# Altium schematic sheet Voltage_conversion.SchDoc
size A4; SheetNumber: 3; SheetTotal: 13
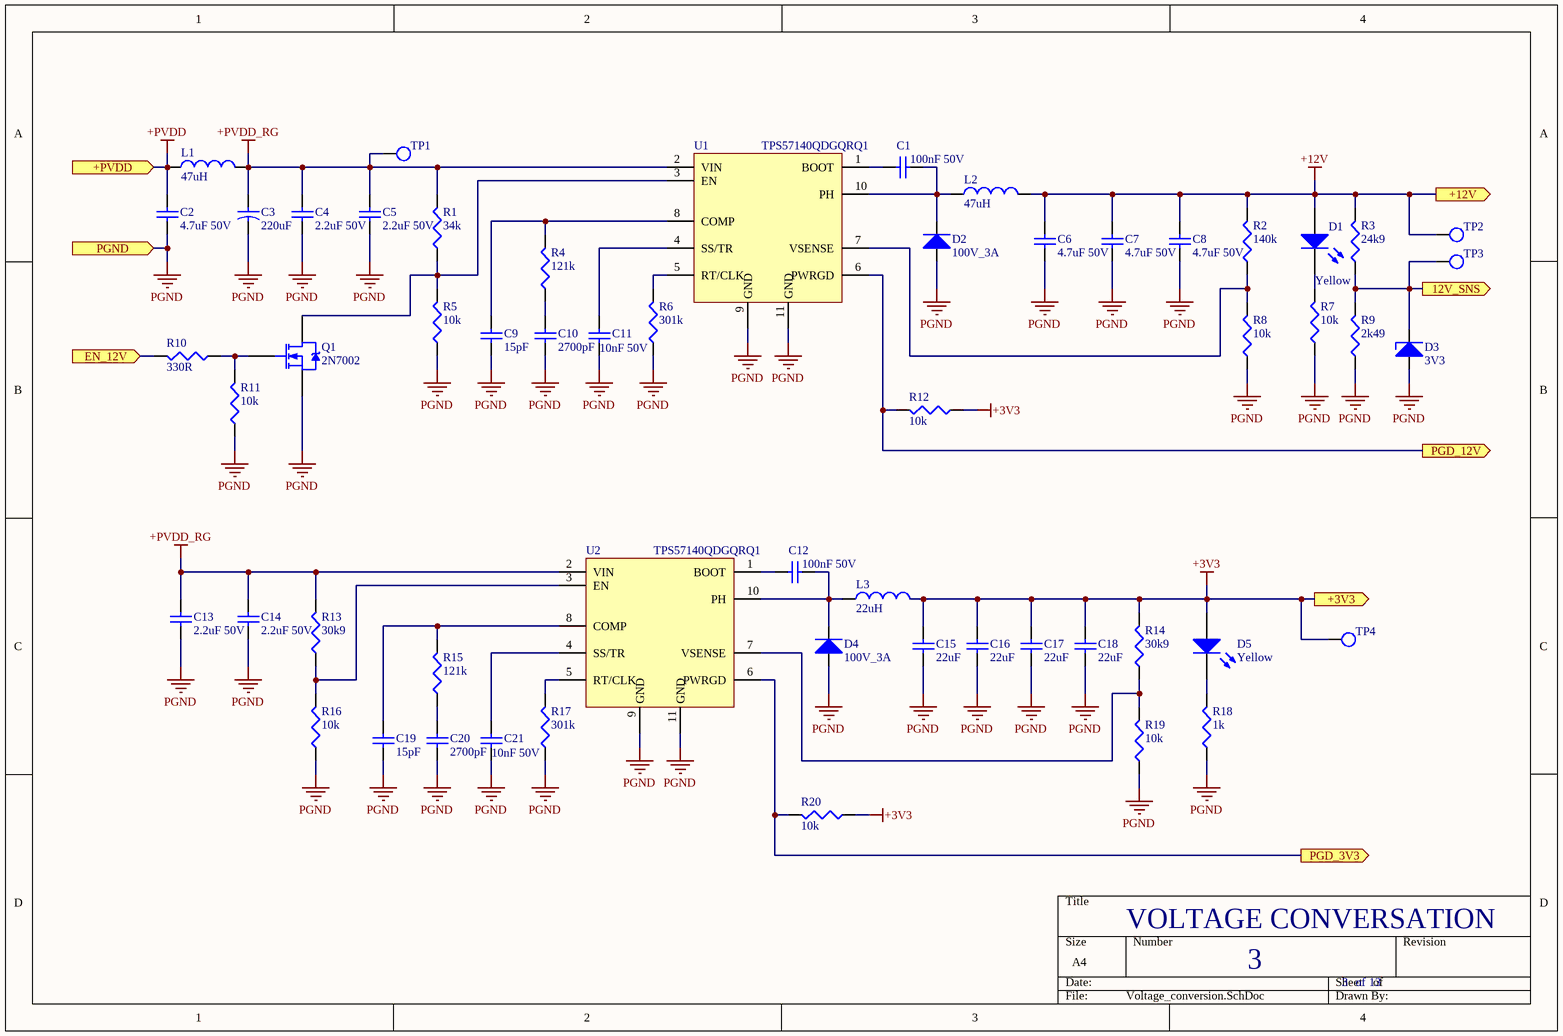
[diagram p0: Voltage_conversion.SchDoc]

## Parts
C1  100nF 50V  [CAP0603]
C2  4.7uF 50V  [CAP1206]
C3  220uF  [CAP_RADIAL_SMD_10x10]
C4  2.2uF 50V  [CAP1206]
C5  2.2uF 50V  [CAP1206]
C6  4.7uF 50V  [CAP1206]
C7  4.7uF 50V  [CAP1206]
C8  4.7uF 50V  [CAP1206]
C9  15pF  [CAP0603]
C10  2700pF  [CAP0603]
C11  10nF 50V  [CAP0603]
C12  100nF 50V  [CAP0603]
C13  2.2uF 50V  [CAP1206]
C14  2.2uF 50V  [CAP1206]
C15  22uF  [CAP1206]
C16  22uF  [CAP1206]
C17  22uF  [CAP1206]
C18  22uF  [CAP1206]
C19  15pF  [CAP0603]
C20  2700pF  [CAP0603]
C21  10nF 50V  [CAP0603]
D1  Yellow  [LED0603]
D2  100V_3A  [DO-221A]
D3  3V3  [SOD323]
D4  100V_3A  [DO-221A]
D5  Yellow  [LED0603]
L1  47uH  [IND_SRR1208]
L2  47uH  [IND_SRR1208]
L3  22uH  [IND_VLS]
Q1  2N7002  [SOT23_2N7002]
R1  34k  [RES0603]
R2  140k  [RES0603]
R3  24k9  [RES0603]
R4  121k  [RES0603]
R5  10k  [RES0603]
R6  301k  [RES0603]
R7  10k  [RES0603]
R8  10k  [RES0603]
R9  2k49  [RES0603]
R10  330R  [RES0603]
R11  10k  [RES0603]
R12  10k  [RES0603]
R13  30k9  [RES0603]
R14  30k9  [RES0603]
R15  121k  [RES0603]
R16  10k  [RES0603]
R17  301k  [RES0603]
R18  1k  [RES0603]
R19  10k  [RES0603]
R20  10k  [RES0603]
TP1  TEST_POINT  [TEST_POINT_TH]  (value not drawn)  (no BOM)
TP2  TEST_POINT  [TEST_POINT_TH]  (value not drawn)  (no BOM)
TP3  TEST_POINT  [TEST_POINT_TH]  (value not drawn)  (no BOM)
TP4  TEST_POINT  [TEST_POINT_TH]  (value not drawn)  (no BOM)
U1  P/N: TPS57140QDGQRQ1  [MSOP_EP]  (hidden comment: 1.5A)
U2  P/N: TPS57140QDGQRQ1  [MSOP_EP]  (hidden comment: 1.5A)

## Ports
12V_SNS (out), +3V3 (out), +12V (out), +PVDD (in), EN_12V (in), PGD_3V3 (out), PGD_12V (out), PGND (in)

## Nets
+3V3: C15.2 C16.2 C17.2 C18.2 D5.1(A) L3.2 R12.1 R14.2 R20.1 TP4.1 ; port +3V3
+12V: C6.2 C7.2 C8.2 D1.1(A) L2.2 R2.2 R3.2 TP2.1 ; port +12V
+PVDD: C2.2 L1.1 ; port +PVDD
+PVDD_RG: C3.1 C4.2 C5.2 C13.2 C14.2 L1.2 R1.2 R13.2 TP1.1 U1.2(VIN) U2.2(VIN)
PGND: C2.1 C3.2 C4.1 C5.1 C6.1 C7.1 C8.1 C9.1 C10.1 C11.1 C13.1 C14.1 C15.1 C16.1 C17.1 C18.1 C19.1 C20.1 C21.1 D2.2(A) D3.2(A) D4.2(A) Q1.2(S) R5.1 R6.1 R7.1 R8.1 R9.1 R11.1 R16.1 R17.1 R18.1 R19.1 U1.9(GND) U1.11(GND) U2.9(GND) U2.11(GND) ; port PGND
12V_SNS: D3.1(K) R3.1 R9.2 TP3.1 ; port 12V_SNS
EN_12V: R10.2 ; port EN_12V
PGD_3V3: R20.2 U2.6(PWRGD) ; port PGD_3V3
PGD_12V: R12.2 U1.6(PWRGD) ; port PGD_12V
NetC1_1: C1.1 D2.1(K) L2.1 U1.10(PH)
NetC1_2: C1.2 U1.1(BOOT)
NetC9_2: C9.2 R4.2 U1.8(COMP)
NetC10_2: C10.2 R4.1
NetC11_2: C11.2 U1.4(SS/TR)
NetC12_1: C12.1 D4.1(K) L3.1 U2.10(PH)
NetC12_2: C12.2 U2.1(BOOT)
NetC19_2: C19.2 R15.2 U2.8(COMP)
NetC20_2: C20.2 R15.1
NetC21_2: C21.2 U2.4(SS/TR)
NetD1_2: D1.2(K) R7.2
NetD5_2: D5.2(K) R18.2
NetQ1_1: Q1.1(G) R10.1 R11.2
NetQ1_3: Q1.3(D) R1.1 R5.2 U1.3(EN)
NetR2_1: R2.1 R8.2 U1.7(VSENSE)
NetR6_2: R6.2 U1.5(RT/CLK)
NetR13_1: R13.1 R16.2 U2.3(EN)
NetR14_1: R14.1 R19.2 U2.7(VSENSE)
NetR17_2: R17.2 U2.5(RT/CLK)

## Notes on the sheet
- VOLTAGE CONVERSATION
- of

## Library data of the parts
C1 C12 = CAP0603_100nF: CAP CER 0.1UF 50V X7R 0603; P/N: C0603C104K5RACTU; Order Code: DIGI : 399-5089-1-ND; Value: 100nF 50V
C2 C6-C8 = CAP1206_4.7uF: CAP CER 4.7UF 50V %20 X7R 1206; P/N: GRJ31CR71H475KE11L; Order Code: DIGI : 490-10944-1-ND; Value: 4.7uF 50V
C3 = CAP_RADIAL_EEE-FK1H221GP: CAP ALUM 220UF 20% 50V SMD; Value: 220uF 50V; Order Code: DIGI : PCE4324CT-ND; P/N: EEE-FK1H221GP
C4 C5 C13 C14 = CAP1206_2.2uF_50V: CAP CER 2.2UF 50V X7R 1206; P/N: C1206X225K5RACAUTO; Order Code: DIGI : 399-7041-1-ND; Value: 2.2uF 50V
C9 C19 = CAP0603_15pF: CAP CER 15PF 50V C0G/NP0 0603; P/N: 06035A150JAT4A; Order Code: DIGI : 478-10677-1-ND; Value: 15pF 50V
C10 C20 = CAP0603_2700pF: CAP CER 1200PF 50V X7R 0603; P/N: CL10B272KB8NNNC; Value: 2700pF 50V; Order Code: DIGI : 1276-2022-1-ND
C11 C21 = CAP0603_10nF: CAP CER 10nF 50V X7R 0603; P/N: C0603C103K5RACTU; Order Code: DIGI : 399-1091-1-ND; Value: 10nF 50V
C15-C18 = CAP1206_22uF_16V: CAP CER 22UF 16V X6S 1206; P/N: GRT31CC81C226KE01L; Order Code: DIGI : 490-12409-1-ND; Value: 22uF
D1 D5 = LED0603_YELLOW: LED YELLOW CLEAR 0603 SMD; P/N: 150060YS75000; Order Code: DIGI : 732-4981-1-ND; Value: Yellow
D2 D4 = FRED_VS-3EYH01-M3/H_100V_3A: DIODE FRED 100V 3A DO-221AD; Value: 100V 3A; Order Code: DIGI : 112-VS-3EYH01-M3/HCT-ND; P/N: VS-3EYH01-M3/H
D3 = ZENER_3V3_MM3Z3V3T1G: DIODE ZENER 3.3V 300MW SOD323; Order Code: DIGI : MM3Z3V3T1GOSCT-ND; P/N: MM3Z3V3T1G; Value: 3V3
L1 L2 = IND_SRR1280-470M: FIXED IND 47UH 2.9A 80 MOHM SMD; Order Code: DIGI : SRR1280-470MCT-ND; P/N: SRR1280-470M; Value: 47uH
L3 = IND_VLS6045EX-220M-H: FIXED IND 22UH 1.9A 105MOHM SMD; Order Code: DIGI : 445-180935-1-ND; P/N: VLS6045EX-220M-H; Value: 22uH
Q1 = 2N7002P,215_NMOS_60V: MOSFET N-CH 60V 0.36A SOT-23; Value: 60V 360mA; Order Code: DIGI : 1727-4692-1-ND; P/N: 2N7002P,215
R1 = RES0603_34k: RES SMD 34K OHM 1% 1/10W 0603; Order Code: DIGI : P34.0KHCT-ND; P/N: ERJ-3EKF3402V; ART Code: ART0022192; Value: 34k
R2 = RES0603_140k: RES 1470 OHM 1% 1/10W 0603; Order Code: DIGI : RMCF0603FT140KCT-ND; P/N: RMCF0603FT140K; Value: 140k
R3 = RES0603_24k9: RES SMD 24.9K OHM 1% 1/10W 0603; Order Code: DIGI : P24.9KHCT-ND; P/N: ERJ-3EKF2492V; Value: 24k9
R4 R15 = RES0603_121k: RES 121K OHM 1% 1/10W 0603; Order Code: DIGI : RMCF0603FT121KCT-ND; P/N: RMCF0603FT121K; Value: 121k
R5 R7 R8 R11 R12 R16 R19 R20 = RES0603_10k: RES SMD 10K OHM 5% 1/10W 0603; Order Code: DIGI : 311-10KGRCT-ND; P/N: RC0603JR-0710KL; ART Code: ART0020747; Value: 10k
R6 R17 = RES0603_301k: RES SMD 301K OHM 1% 1/10W 0603; Order Code: DIGI : 311-301KHRCT-ND; P/N: RC0603FR-07301KL; ART Code: ART0023385; Value: 301k
R9 = RES0603_2k49: RES 2.49K OHM 1% 1/10W 0603; Order Code: DIGI : RMCF0603FT2K49CT-ND; P/N: RMCF0603FT2K49; ART Code: ART0014241; Value: 2k49
R10 = RES0603_330R: RES 330 OHM 1% 1/10W 0603; Order Code: DIGI : RMCF0603FT330RCT-ND; P/N: RMCF0603FT330R; ART Code: ART0021648; Value: 330R
R13 R14 = RES0603_30k9: RES SMD 30K9 OHM 1% 1/10W 0603; Order Code: DIGI : RMCF0603FT30K9CT-ND; P/N: RMCF0603FT30K9; Value: 30k9
R18 = RES0603_1k: RES SMD 1K OHM 1% 1/10W 0603; Order Code: DIGI : 311-1.00KHRCT-ND; P/N: RC0603FR-071KL; ART Code: ART0014240; Value: 1k
U1 U2 = REG_SMPS_TPS57140QDGQRQ1: IC REG BUCK ADJ 1.5A 10MSOP; Order Code: DIGI : 296-28157-1-ND; Value: 1.5A